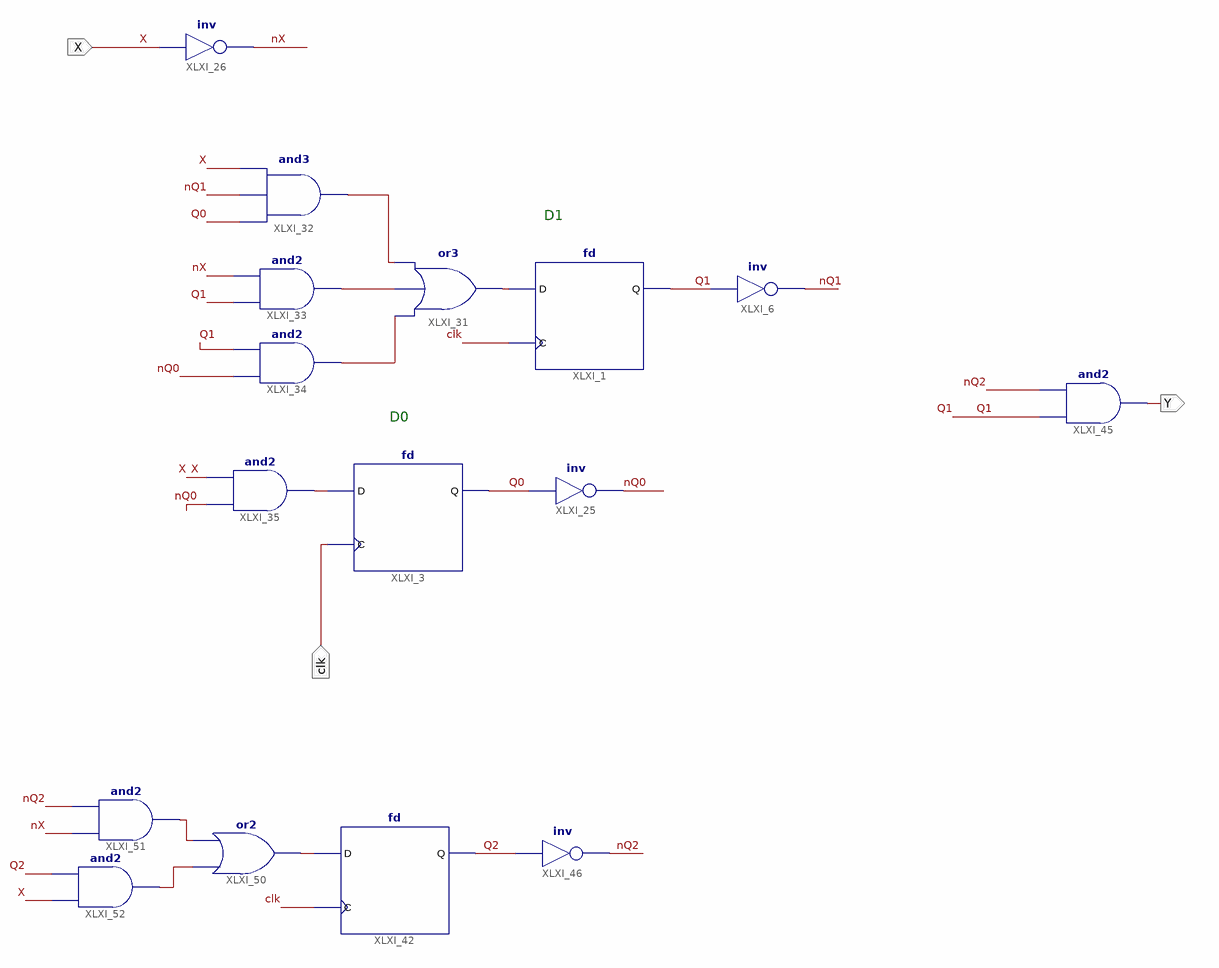
[diagram p0: schematic sheet 1]
// Xilinx ISE schematic p1.sch (artix7) as structural Verilog: 16 symbols, 3 ports
module p1 (
  input  X,
  input  clk,
  output Y
);

  wire nQ0, nQ1, nQ2, nX, Q0, Q1, Q2, XLXN_29, XLXN_40, XLXN_51, XLXN_53, XLXN_54, XLXN_77, XLXN_98, XLXN_99;

  fd XLXI_1 (.C(clk), .D(XLXN_29), .Q(Q1));
  not XLXI_6 (nQ1, Q1);
  or XLXI_31 (XLXN_29, XLXN_54, XLXN_53, XLXN_51);
  and XLXI_32 (XLXN_51, Q0, nQ1, X);
  and XLXI_33 (XLXN_53, Q1, nX);
  and XLXI_34 (XLXN_54, nQ0, Q1);
  and XLXI_35 (XLXN_40, nQ0, X);
  not XLXI_25 (nQ0, Q0);
  fd XLXI_3 (.C(clk), .D(XLXN_40), .Q(Q0));
  fd XLXI_42 (.C(clk), .D(XLXN_77), .Q(Q2));
  and XLXI_45 (Y, Q1, nQ2);
  not XLXI_46 (nQ2, Q2);
  not XLXI_26 (nX, X);
  or XLXI_50 (XLXN_77, XLXN_99, XLXN_98);
  and XLXI_51 (XLXN_98, nX, nQ2);
  and XLXI_52 (XLXN_99, X, Q2);

  // Notes on the sheet:
  //   D1
  //   D0
endmodule
